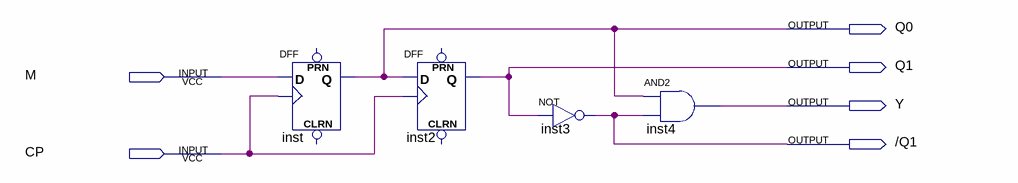
[diagram p0: schematic sheet]
// Quartus schematic trig.bdf as structural Verilog: 4 symbols, 6 pins
module trig (
  input  M,
  input  CP,
  output Q0,
  output Q1,
  output Y,
  output \/Q1 
);

  DFF inst (.CLK(CP), .D(M), .Q(Q0));  // open: CLRN, PRN
  DFF inst2 (.CLK(CP), .D(Q0), .Q(Q1));  // open: CLRN, PRN
  not inst3 (\/Q1 , Q1);
  and inst4 (Y, Q0, \/Q1 );
endmodule
